# Altium project Final_Year_Project.PrjPcb
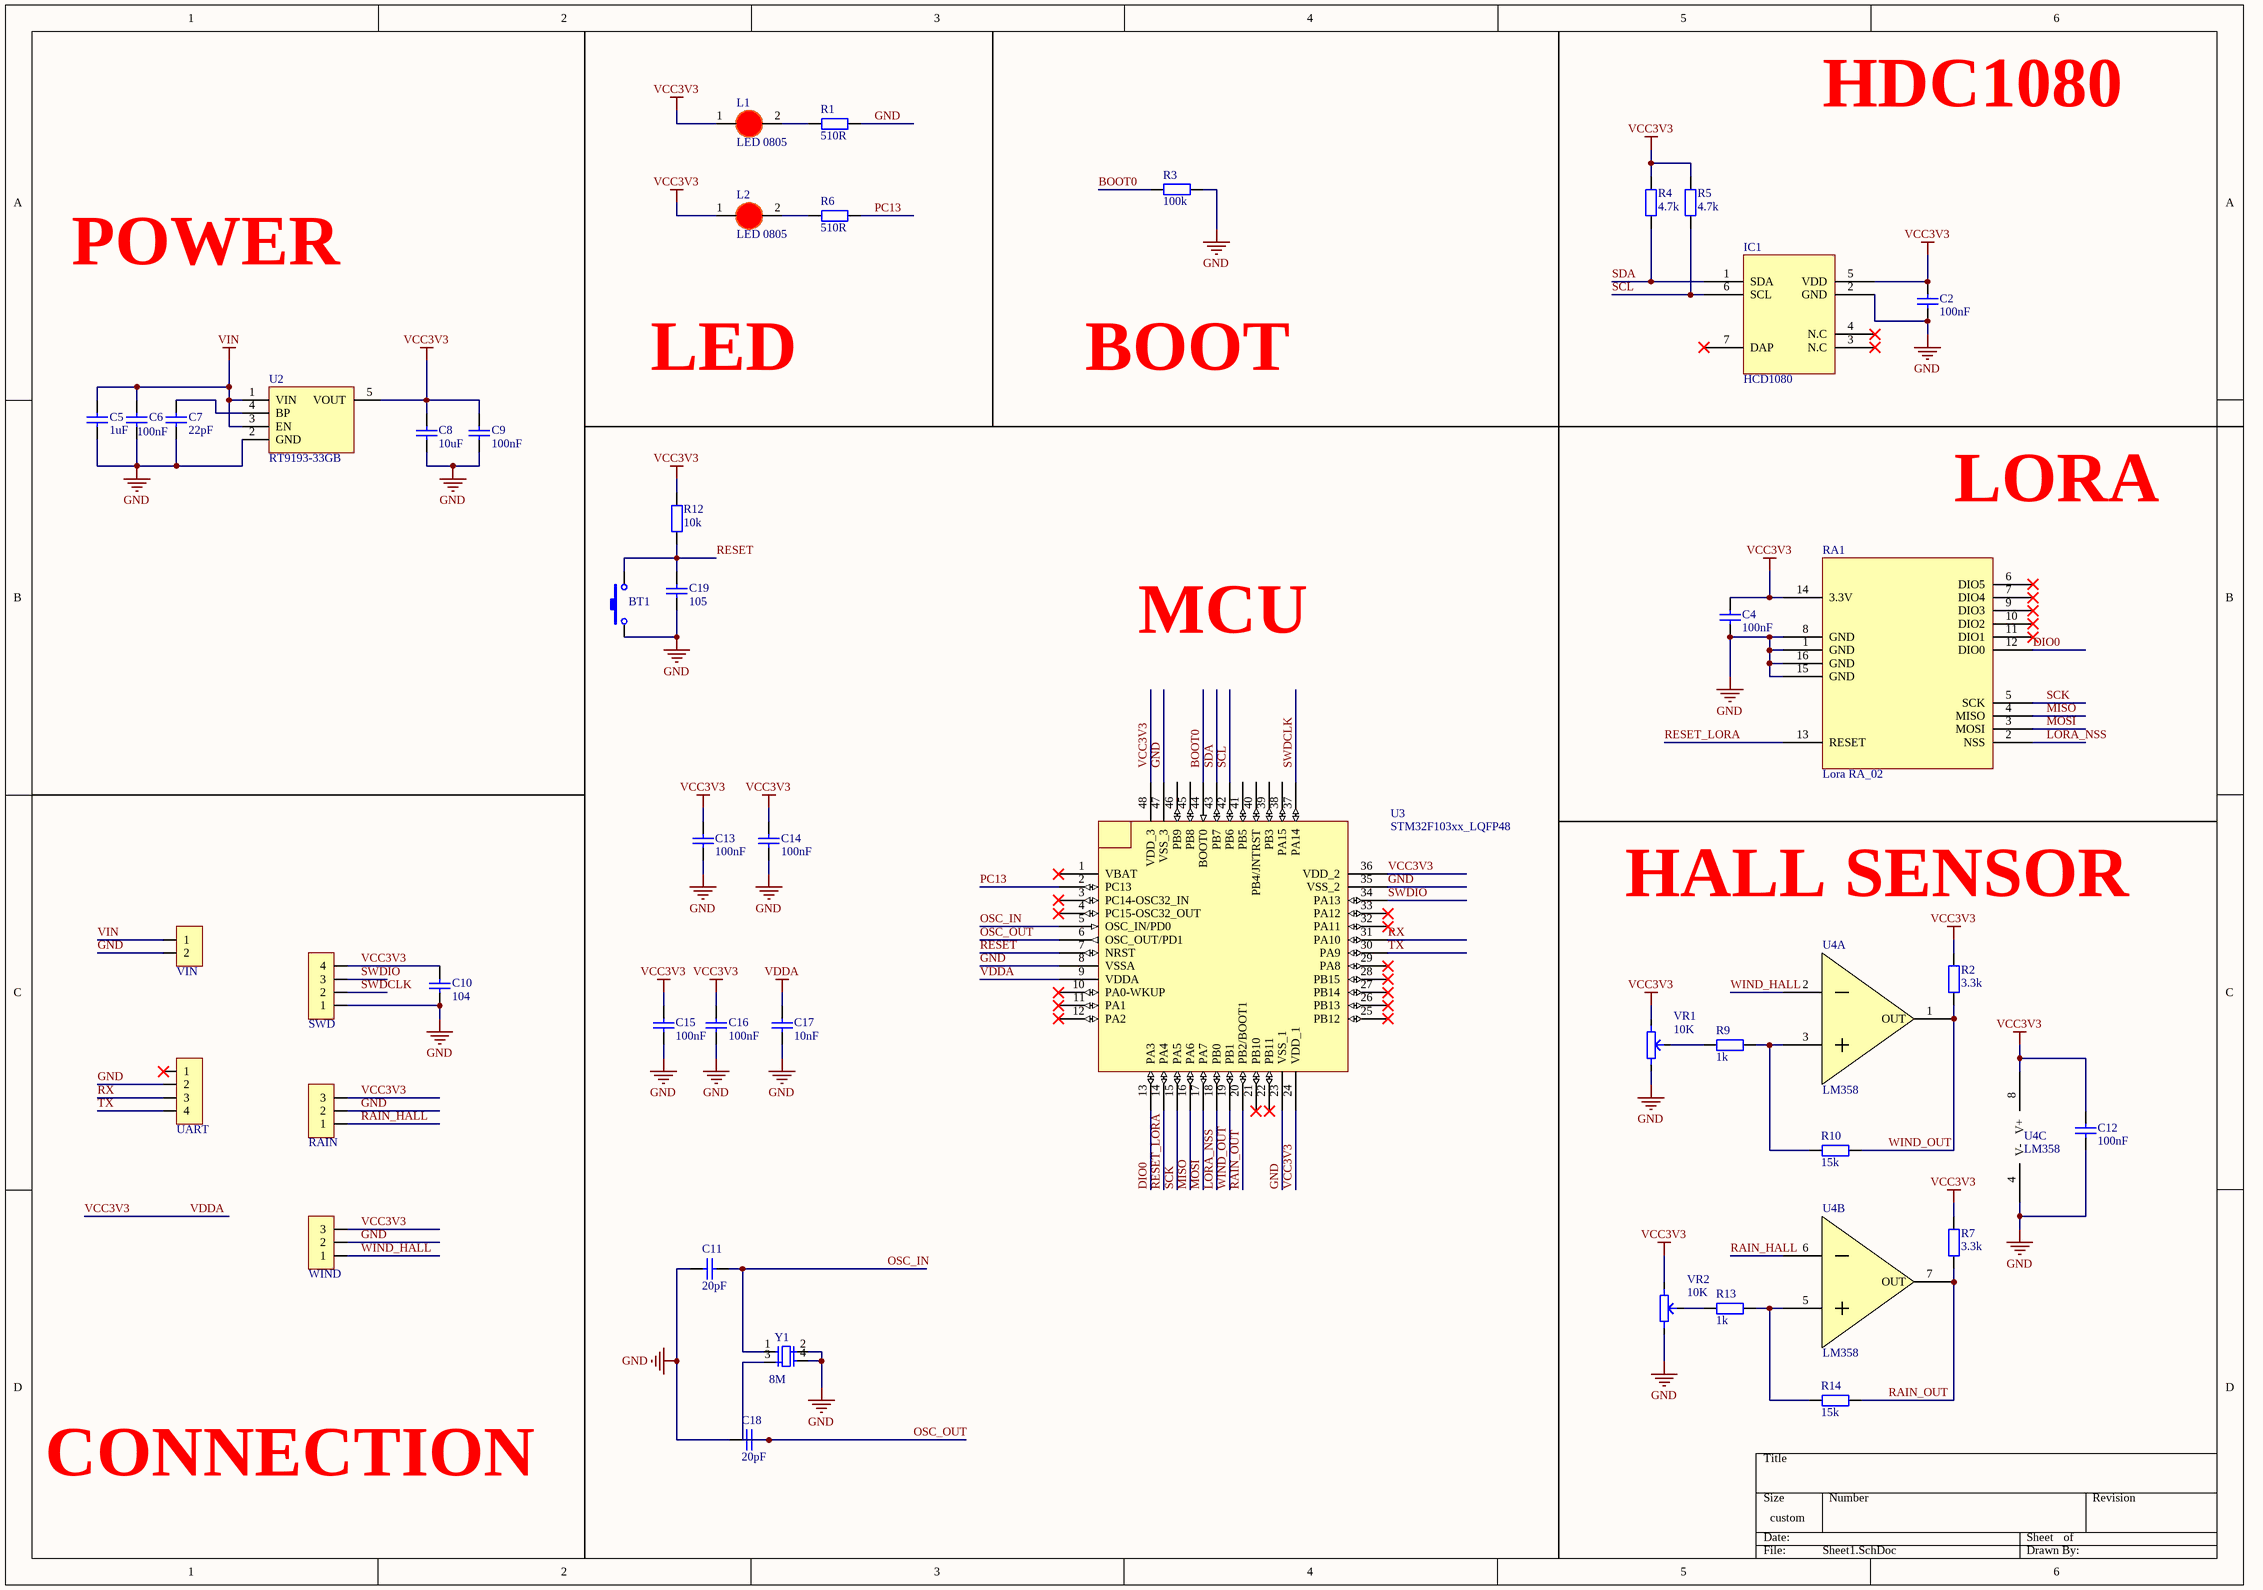
[diagram p0: Sheet1.SchDoc]
1 sheet, 45 parts. Net scope: global (net labels, ports and power ports of the same name join across sheets).
Board file: PCB1.PcbDoc

## Sheet Sheet1.SchDoc
size 431 x 304 mm; SheetNumber: 1; SheetTotal: 1

### Parts
BT1  Nut Nhan 2 Chan SMD 3x6x2.5  [Nut Nhan 2 Chan SMD 3x6x2.5]  (value not drawn)
C2  100nF  [tu 0603]
C4  100nF  [tu 0603]
C5  1uF  [tu 0603]
C6  100nF  [tu 0603]
C7  22pF  [tu 0603]
C8  10uF  [tu 0603]
C9  100nF  [tu 0603]
C10  104  [tu 0603]
C11  20pF  [tu 0603]
C12  100nF  [tu 0603]
C13  100nF  [tu 0603]
C14  100nF  [tu 0603]
C15  100nF  [tu 0603]
C16  100nF  [tu 0603]
C17  10nF  [tu 0603]
C18  20pF  [tu 0603]
C19  105  [tu 0603]
IC1  HCD1080  [HDC1080]
JP1  VIN  [JP 1x2 DT]
JP2  SWD  [JP 1x4 DT]
JP3  UART  [JP 1x4 DT]
JP4  RAIN  [JP 1x3 CT]
JP5  WIND  [JP 1x3 CT]
L1  LED 0805  [LED-0805-Red]
L2  LED 0805  [LED-0805-Red]
R1  510R  [tro smd 0603]
R2  3.3k  [tro smd 0603]
R3  100k  [tro smd 0603]
R4  4.7k  [tro smd 0603]
R5  4.7k  [tro smd 0603]
R6  510R  [tro smd 0603]
R7  3.3k  [tro smd 0603]
R9  1k  [tro smd 0603]
R10  15k  [tro smd 0603]
R12  10k  [tro smd 0603]
R13  1k  [tro smd 0603]
R14  15k  [tro smd 0603]
RA1  Lora RA_02  [SOP16]
U2  RT9193-33GB  [SOT23-5]
U3  STM32F103xx_LQFP48  [STM32_LQPF48]
U4  LM358  [LM393]  (parts A,B,C of 3)
VR1  10K  [Bien Tro Tam Giac Dung]
VR2  10K  [Bien Tro Tam Giac Dung]
Y1  8M  [Thach Anh 4 chan 1]

### Nets
GND: BT1.1 C2.2 C4.2 C5.2 C6.2 C7.2 C8.2 C9.2 C10.2 C11.2 C12.2 C13.2 C14.2 C15.2 C16.2 C17.2 C18.2 C19.2 IC1.2(GND) JP1.2 JP2.1 JP3.2 JP4.2 JP5.2 R1.2 R3.2 RA1.1(GND) RA1.8(GND) RA1.15(GND) RA1.16(GND) U2.2(GND) U3.8(VSSA) U3.23(VSS_1) U3.35(VSS_2) U3.47(VSS_3) U4.4(V-) VR1.3 VR2.3 Y1.2 Y1.4
VCC3V3: C2.1 C4.1 C8.1 C9.1 C10.1 C12.1 C13.1 C14.1 C15.1 C16.1 C17.1 IC1.5(VDD) JP2.4 JP4.3 JP5.3 L1.1(A) L2.1(A) R2.2 R4.2 R5.2 R7.2 R12.2 RA1.14(3.3V) U2.5(VOUT) U3.9(VDDA) U3.24(VDD_1) U3.36(VDD_2) U3.48(VDD_3) U4.8(V+) VR1.1 VR2.1  [also labelled VDDA]
VIN: C5.1 C6.1 JP1.1 U2.1(VIN) U2.3(EN)
BOOT0: R3.1 U3.44(BOOT0)
DIO0: RA1.12(DIO0) U3.13(PA3)
LORA_NSS: RA1.2(NSS) U3.18(PB0)
MISO: RA1.4(MISO) U3.16(PA6)
MOSI: RA1.3(MOSI) U3.17(PA7)
OSC_IN: C11.1 U3.5(OSC_IN/PD0) Y1.1
OSC_OUT: C18.1 U3.6(OSC_OUT/PD1) Y1.3
PC13: R6.2 U3.2(PC13)
RAIN_HALL: JP4.1 U4.6(-)
RAIN_OUT: R7.1 R14.2 U3.20(PB2/BOOT1) U4.7(OUT)
RESET: BT1.2 C19.1 R12.1 U3.7(NRST)
RESET_LORA: RA1.13(RESET) U3.14(PA4)
RX: JP3.3 U3.31(PA10)
SCK: RA1.5(SCK) U3.15(PA5)
SCL: IC1.6(SCL) R5.1 U3.42(PB6)
SDA: IC1.1(SDA) R4.1 U3.43(PB7)
SWDCLK: JP2.2 U3.37(PA14)
SWDIO: JP2.3 U3.34(PA13)
TX: JP3.4 U3.30(PA9)
WIND_HALL: JP5.1 U4.2(-)
WIND_OUT: R2.1 R10.2 U3.19(PB1) U4.1(OUT)
NetC7_1: C7.1 U2.4(BP)
NetL1_2: L1.2(K) R1.1
NetL2_2: L2.2(K) R6.1
NetR9_1: R9.1 VR1.2
NetR9_2: R9.2 R10.1 U4.3(+)
NetR13_1: R13.1 VR2.2
NetR13_2: R13.2 R14.1 U4.5(+)

Not connected (* = marked no-connect by the designer): IC1 3(N.C)* 4(N.C)* 7(DAP)*; JP3 1*; RA1 6(DIO5)* 7(DIO4)* 9(DIO3)* 10(DIO2)* 11(DIO1)*; U3 1(VBAT)* 3(PC14-OSC32_IN)* 4(PC15-OSC32_OUT)* 10(PA0-WKUP)* 11(PA1)* 12(PA2)* 21(PB10)* 22(PB11)* 25(PB12)* 26(PB13)* 27(PB14)* 28(PB15)* 29(PA8)* 32(PA11)* 33(PA12)* 38(PA15) 39(PB3) 40(PB4/JNTRST) 41(PB5) 45(PB8) 46(PB9)

### Notes on the sheet
- HDC1080
- POWER
- LED
- BOOT
- LORA
- MCU
- HALL SENSOR
- CONNECTION

### Library data of the parts
BT1 = Nut Nhan 2 Chan SMD 3x6x2.5: Ma_Hang: MH001036; Ten: Nút Nhấn 2 Chân 3x6x2.5MM SMD
C2 C4 C6 C9 C10 C13-C16 = Tu 0603 104 50V 10%: Dán; Don_Vi: Con; So_Chan: 2; Ten_Linh_Kien: Tụ 0603 104-100nF 10% 50V; Ma_Hang: MH004568; Chung_Loai: Dán; Kieu_Chan: *
C5 = Tu 0603 105 16V 20%: Dán; Don_Vi: Con; So_Chan: 2; Ten_Linh_Kien: Tụ 0603 105-1uF 20% 16V; Ma_Hang: MH004574; Chung_Loai: Dán; Kieu_Chan: *
C7 = Tu 0603 22pF 50V 10%: Dán; Don_Vi: Con; So_Chan: 2; Ten_Linh_Kien: Tụ 0603 22pF 50V 10%; Ma_Hang: MH004570; Chung_Loai: Dán; Kieu_Chan: *
C8 = Tu 0603 106 16V 20%: Dán; Don_Vi: Con; So_Chan: 2; Ten_Linh_Kien: Tụ 0603-10uF 20% 16V; Ma_Hang: MH004848; Chung_Loai: Dán; Kieu_Chan: *
C11 C18 = Tu 0805 20pF 50V 10%: Dán; Don_Vi: Con; Ten_Linh_Kien: Tụ 0805 20P 10% 50V; So_Chan: 2; Ma_Hang: MH004558; Chung_Loai: Dán; Kieu_Chan: *
C12 = Tu 0805 104 50V 10%: Dán; Don_Vi: Con; So_Chan: 2; Ten_Linh_Kien: Tụ 0805 104-100nF 10% 50V; Ma_Hang: MH004551; Chung_Loai: Dán; Kieu_Chan: *
C17 = Tu 0603 103 50V 10%: Dán; Don_Vi: Con; So_Chan: 2; Ten_Linh_Kien: Tụ 0603 103-10nF 10% 50V; Ma_Hang: MH004567; Chung_Loai: Dán; Kieu_Chan: *
C19 = Tu 0603 105 50V 10%: Dán; Don_Vi: Con; So_Chan: 2; Ten_Linh_Kien: Tụ 0603 105-1uF 50V 10%; Ma_Hang: MH004569; Chung_Loai: Dán; Kieu_Chan: *
JP1 = JP 1x2 2.54 Duc Thang: Cắm; Ten_Linh_Kien: Jump Đơn Đực 2.54MM 1x40P Thẳng 11MM; Don_Vi: Con; Ma_Hang: MH000903; Ghi_Chu: *; Kieu_Chan: *; Chung_Loai: Cắm
JP2 JP3 = JP 1x4 2.54 Duc Thang: Cắm; Ten_Linh_Kien: Jump Đơn Đực 2.54MM 1x40P Thẳng 11MM; Don_Vi: Con; Ma_Hang: MH000903; Ghi_Chu: *; Kieu_Chan: *; Chung_Loai: Cắm
JP4 JP5 = JP 1x3 2.54 Cai Thang: Cắm; Ten_Linh_Kien: Jump Đơn Cái 2.54MM 1x20P Thẳng; Don_Vi: Con; Ma_Hang: MH004006; Ghi_Chu: *; Kieu_Chan: *; Chung_Loai: Cắm
L1 L2 = LED 0805 Do: Dán; Don_Vi: Con; Ma_Hang: MH000897; Ten_Linh_Kien: LED 0805 Màu Đỏ (Red); Ghi_Chu: *; Kieu_Chan: *; Chung_Loai: Dán
R1 R6 = Tro 0603 5% 510R: Dán; Don_Vi: Con; So_Chan: 2; Ten_Linh_Kien: Trở 0603 5% 510R; Ma_Hang: MH007667; Chung_Loai: Dán; Kieu_Chan: *
R2 R7 = Tro 0603 5% 3.3k: Dán; Don_Vi: Con; So_Chan: 2; Ten_Linh_Kien: Trở 0603 5% 3.3k; Ma_Hang: MH006332; Chung_Loai: Dán; Kieu_Chan: *
R3 = Tro 0603 5% 100k: Dán; So_Chan: 2; Ten_Linh_Kien: Trở 0603 5% 100k; Ma_Hang: MH006314; Don_Vi: Con; Chung_Loai: Dán; Kieu_Chan: *
R4 R5 = Tro 0603 1% 1k: Dán; So_Chan: 2; Don_Vi: Con; Ten_Linh_Kien: Trở 0603 1% 1k; Ma_Hang: MH006334; Chung_Loai: Dán; Kieu_Chan: *
R9 R13 = Tro 0805 5% 2.2k: Dán; Don_Vi: Con; So_Chan: 2; Ten_Linh_Kien: Trở 0805 5% 2.2k; Ma_Hang: MH005237; Chung_Loai: Dán; Kieu_Chan: *
R10 R14 = Tro 0805 5% 6.8k: Dán; Don_Vi: Con; So_Chan: 2; Ten_Linh_Kien: Trở 0805 5% 6.8k; Ma_Hang: MH005311; Chung_Loai: Dán; Kieu_Chan: *
R12 = Tro 0603 1% 10k: Dán; Don_Vi: Con; So_Chan: 2; Ten_Linh_Kien: Trở 0603 1% 10k; Ma_Hang: MH006333; Chung_Loai: Dán; Kieu_Chan: *
U2 = REG_5.5V-3.3V-0.3A-1W-SOT-23-5: Linear Voltage Regulator IC 1 Output 300mA SOT-23-5; Manufacturer: Richtek USA Inc.; Alternate Part Number-1: NA; Manufacturer Part Number: RT9193-33GB; Supplier-1: LCSC; Supplier Part Number-1: C15651; Case/Package: SOT-23-5
U4 = LM393
VR1 VR2 = Bien tro tam giac 100K Dung: Cắm; Don_Vi: Con; Ten_Linh_Kien: Biến Trở Tam Giác 104-100K RM065; Ma_Hang: MH003711; Chung_Loai: Cắm; Ghi_Chu: *; Kieu_Chan: *
Y1 = Thach Anh 4 Chan SMD: Crystal For all Crystal 2pin.; Value: 4Mhz
U3 = STM32F103xx_LQFP48: Published: 30-May-2008; DatasheetVersion: rev6, Mar-2008; PackageVersion: Mar-2008; PackageReference: LQFP48; Publisher: Altium Limited; PackageDescription: 48-Pin Low-Profile Quad Flat Pack, 7 x 7 mm Body, 0.5 mm Pitch (LQFP48); ComponentLink1Description: Manufacturer Link; ComponentLink1URL: www.st.com/stm32; ComponentLink2Description: Datasheet; ComponentLink2URL: http://www.st.com/stonline/products/literature/ds/13587.pdf